# EAGLE design Pico_Feeder_V3 (EAGLE 9.7.0)
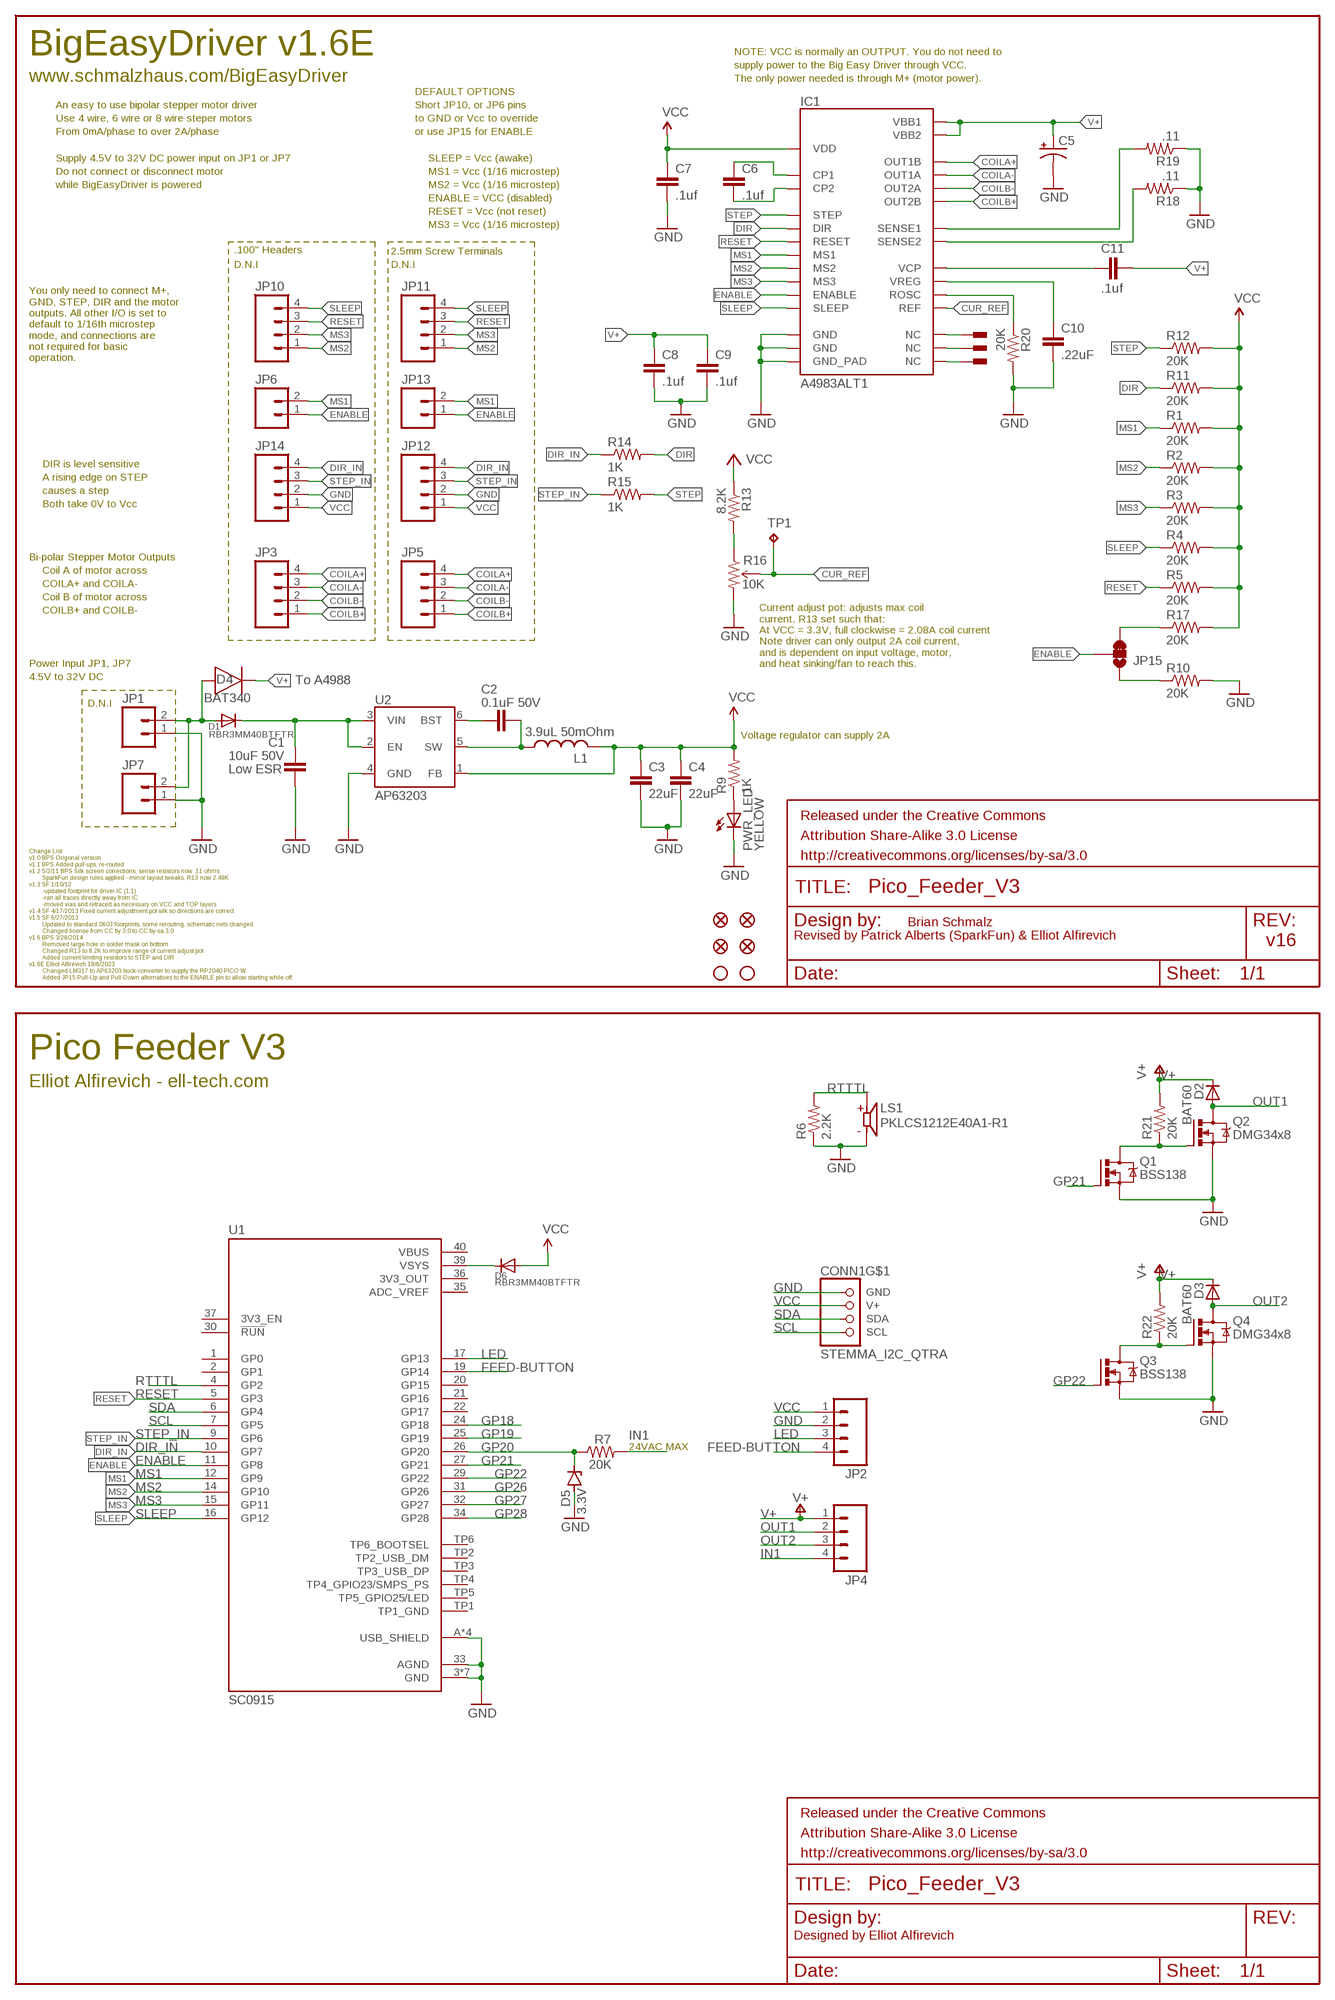
[diagram p0: schematic, sheet 1]

## Parts
C1  10uF 50V  C_CHIP-0805(2012-METRIC)  [CAPC2012X110]
C2  0.1uF 50V  C_CHIP-0805(2012-METRIC)  [CAPC2012X110]
C3  22uF  0.22UF50V-20%,+80%(0603)  [0603-CAP]
C4  22uF  0.22UF50V-20%,+80%(0603)  [0603-CAP]
C5  CPOL-USD  [PANASONIC_D]
C6  .1uf  0.1UF-100V-10%(0603)  [0603-CAP]
C7  .1uf  0.1UF-100V-10%(0603)  [0603-CAP]
C8  .1uf  0.1UF-100V-10%(0603)  [0603-CAP]
C9  .1uf  0.1UF-100V-10%(0603)  [0603-CAP]
C10  .22uF  0.22UF50V-20%,+80%(0603)  [0603-CAP]
C11  .1uf  0.1UF-100V-10%(0603)  [0603-CAP]
CONN1  STEMMA_I2C_QTRA  [JST_SH4_RA]
D1  RBR3MM40BTFTR  DIODE_SOD-123FL  [SOD-123FL]
D2  BAT60  DIODE-SOD323-R  [SOD323-R]
D3  BAT60  DIODE-SOD323-R  [SOD323-R]
D4  BAT340  DIODEDO-214AC(SMA)  [DIOM5226X290N]
D5  3.3V  ZENER_DO-219-AC(SOD323F)  [SODFL2513X70]
D6  RBR3MM40BTFTR  DIODE_SOD-123FL  [SOD-123FL]
FID1  FIDUCIAL1X2  [FIDUCIAL-1X2]
FID2  FIDUCIAL1X2  [FIDUCIAL-1X2]
FID3  FIDUCIAL1X2  [FIDUCIAL-1X2]
FID4  FIDUCIAL1X2  [FIDUCIAL-1X2]
FRAME1  FRAME-LETTER  [CREATIVE_COMMONS]
FRAME2  FRAME-LETTER  [CREATIVE_COMMONS]
IC1  A4983ALT1  [QFN-28-5MM_ALT1]
JP1  M02PTH  [1X02]
JP2  M04SCREW_LOCK  [SCREWTERMINAL-3.5MM-4_LOCK]
JP3  M04PTH  [1X04]
JP4  M04SCREW_LOCK  [SCREWTERMINAL-3.5MM-4_LOCK]
JP5  M04SCREW_LOCK  [SCREWTERMINAL-3.5MM-4_LOCK]
JP6  M02PTH  [1X02]
JP7  M023.5MM_LOCK  [SCREWTERMINAL-3.5MM-2_LOCK]
JP8  STAND-OFF  [STAND-OFF]
JP9  STAND-OFF  [STAND-OFF]
JP10  M04PTH  [1X04]
JP11  M04SCREW_LOCK  [SCREWTERMINAL-3.5MM-4_LOCK]
JP12  M04SCREW_LOCK  [SCREWTERMINAL-3.5MM-4_LOCK]
JP13  M023.5MM_LOCK  [SCREWTERMINAL-3.5MM-2_LOCK]
JP14  M04PTH  [1X04]
JP15  JUMPER-SMT_3_1-NC_TRACE_SILK  [SMT-JUMPER_3_1-NC_TRACE_SILK]
L1  3.9uL 50mOhm  L-LQH55  [LQH55]
LS1  PKLCS1212E40A1-R1  [SPKR_PKLCS1212E40A1-R1]
PWR_LED  YELLOW  LED0603  [LED-0603]
Q1  BSS138  NMOSFETSOT23-GSD  [SOT23]
Q2  DMG34x8  NMOSFETSOT23-GSD  [SOT23]
Q3  BSS138  NMOSFETSOT23-GSD  [SOT23]
Q4  DMG34x8  NMOSFETSOT23-GSD  [SOT23]
R1  20K  20KOHM1/10W5%(0603)  [0603-RES]
R2  20K  20KOHM1/10W5%(0603)  [0603-RES]
R3  20K  20KOHM1/10W5%(0603)  [0603-RES]
R4  20K  20KOHM1/10W5%(0603)  [0603-RES]
R5  20K  20KOHM1/10W5%(0603)  [0603-RES]
R6  2.2K  240OHM1/10W1%(0603)  [0603-RES]
R7  20K  1KOHM1/10W1%(0603)  [0603-RES]
R9  1K  1KOHM1/10W1%(0603)  [0603-RES]
R10  20K  20KOHM1/10W5%(0603)  [0603-RES]
R11  20K  20KOHM1/10W5%(0603)  [0603-RES]
R12  20K  20KOHM1/10W5%(0603)  [0603-RES]
R13  8.2K  8.2KOHM-1/10W-5%(0603)  [0603-RES]
R14  1K  1KOHM1/10W1%(0603)  [0603-RES]
R15  1K  1KOHM1/10W1%(0603)  [0603-RES]
R16  10K  TRIMPOT3MM-2  [TRIMPOT-3MM-2]
R17  20K  20KOHM1/10W5%(0603)  [0603-RES]
R18  .11  0.11OHM1/2W1%(2010)  [R2010]
R19  .11  0.11OHM1/2W1%(2010)  [R2010]
R20  20K  20KOHM1/10W5%(0603)  [0603-RES]
R21  20K  240OHM1/10W1%(0603)  [0603-RES]
R22  20K  240OHM1/10W1%(0603)  [0603-RES]
TP1  TPPAD1-13  [P1-13]
U1  SC0915  [MODULE_SC0915]
U2  AP63203  [SOT23-6]
U$3  PAD  [PAD-0.008]
U$4  PAD  [PAD-0.008]
U$5  PAD  [PAD-0.008]

## Nets
COILA+: IC1.P$21(OUT1B) JP3.4 JP5.4
COILA-: IC1.P$24(OUT1A) JP3.3 JP5.3
COILB+: IC1.P$1(OUT2B) JP3.1 JP5.1
COILB-: IC1.P$26(OUT2A) JP3.2 JP5.2
CUR_REF: IC1.P$17(REF) R16.2(WIPER) TP1.TP
DIR: IC1.P$19(DIR) R11.1 R14.2
DIR_IN: JP12.4 JP14.4 R14.1 U1.10(GP7)
ENABLE: IC1.P$2(ENABLE) JP6.1 JP13.1 JP15.2 U1.11(GP8)
FEED-BUTTON: JP2.4 U1.19(GP14)
GND: C1.2 C3.2 C4.2 C5.- C7.2 C8.2 C9.2 C10.2 CONN1.1(GND) D5.2(A) IC1.P$3(GND) IC1.P$18(GND) IC1.P$29(GND_PAD) JP1.1 JP2.2 JP7.1 JP12.2 JP14.2 LS1.N PWR_LED.C Q1.2(S) Q2.2(S) Q3.2(S) Q4.2(S) R6.1 R10.2 R16.3(CW) R18.1 R19.1 R20.2 U1.3(GND) U1.8(GND) U1.13(GND) U1.18(GND) U1.23(GND) U1.28(GND) U1.33(AGND) U1.38(GND) U1.A(USB_SHIELD) U1.B(USB_SHIELD) U1.C(USB_SHIELD) U1.D(USB_SHIELD) U2.4(GND)
GP18: U1.24(GP18)
GP19: U1.25(GP19)
GP20: D5.1(C) R7.1 U1.26(GP20)
GP21: Q1.1(G) U1.27(GP21)
GP22: Q3.1(G) U1.29(GP22)
GP26: U1.31(GP26)
GP27: U1.32(GP27)
GP28: U1.34(GP28)
IN1: JP4.4 R7.2
LED: JP2.3 U1.17(GP13)
MS1: IC1.P$9(MS1) JP6.2 JP13.2 R1.1 U1.12(GP9)
MS2: IC1.P$10(MS2) JP10.1 JP11.1 R2.1 U1.14(GP10)
MS3: IC1.P$11(MS3) JP10.2 JP11.2 R3.1 U1.15(GP11)
N$1: C2.1 U2.6(BST)
N$2: PWR_LED.A R9.1
N$3: R13.2 R16.1(CCW)
N$4: C2.2 L1.1 U2.5(SW)
N$5: IC1.P$7(NC) U$3.P$1
N$6: C1.1 D1.C U2.2(EN) U2.3(VIN)
N$7: IC1.P$20(NC) U$4.P$1
N$8: C6.1 IC1.P$4(CP1)
N$9: C6.2 IC1.P$5(CP2)
N$10: IC1.P$25(NC) U$5.P$1
N$11: Q1.3(D) Q2.1(G) R21.1
N$12: D1.A D4.2(A) JP1.2 JP7.2
N$13: D6.C U1.39(VSYS)
N$14: Q3.3(D) Q4.1(G) R22.1
N$15: JP15.3 R17.1
N$16: JP15.1 R10.1
N$19: IC1.P$13(ROSC) R20.1
N$20: C10.1 IC1.P$8(VREG)
N$21: C11.1 IC1.P$6(VCP)
N$31: IC1.P$27(SENSE2) R18.2
N$32: IC1.P$23(SENSE1) R19.2
OUT1: D2.A JP4.2 Q2.3(D)
OUT2: D3.A JP4.3 Q4.3(D)
RESET: IC1.P$12(RESET) JP10.3 JP11.3 R5.1 U1.5(GP3)
RTTTL: LS1.P R6.2 U1.4(GP2)
SCL: CONN1.4(SCL) U1.7(GP5)
SDA: CONN1.3(SDA) U1.6(GP4)
SLEEP: IC1.P$14(SLEEP) JP10.4 JP11.4 R4.1 U1.16(GP12)
STEP: IC1.P$16(STEP) R12.1 R15.2
STEP_IN: JP12.3 JP14.3 R15.1 U1.9(GP6)
V+: C5.+ C8.1 C9.1 C11.2 D2.C D3.C D4.1(C) IC1.P$22(VBB1) IC1.P$28(VBB2) JP4.1 R21.2 R22.2
VCC: C3.1 C4.1 C7.1 CONN1.2(V+) D6.A IC1.P$15(VDD) JP2.1 JP12.1 JP14.1 L1.2 R1.2 R2.2 R3.2 R4.2 R5.2 R9.2 R11.2 R12.2 R13.1 R17.2 U2.1(FB)
Unconnected: CONN1.MT1(MT) CONN1.MT2(MT) U1.1(GP0) U1.2(GP1) U1.20(GP15) U1.21(GP16) U1.22(GP17) U1.30(!RUN) U1.37(3V3_EN) U1.TP2(TP2_USB_DM) U1.TP3(TP3_USB_DP) U1.TP4(TP4_GPIO23/SMPS_PS) U1.TP5(TP5_GPIO25/LED) U1.TP6(TP6_BOOTSEL)

## Notes on the sheet
- BigEasyDriver v1.6E | NOTE: VCC is normally an OUTPUT. You do not need to
- supply power to the Big Easy Driver through VCC.
- www.schmalzhaus.com/BigEasyDriver | The only power needed is through M+ (motor power).
- DEFAULT OPTIONS
- An easy to use bipolar stepper motor driver | Short JP10, or JP6 pins
- Use 4 wire, 6 wire or 8 wire steper motors | to GND or Vcc to override
- From 0mA/phase to over 2A/phase | or use JP15 for ENABLE
- Supply 4.5V to 32V DC power input on JP1 or JP7 | SLEEP = Vcc (awake)
- Do not connect or disconnect motor | MS1 = Vcc (1/16 microstep)
- while BigEasyDriver is powered | MS2 = Vcc (1/16 microstep)
- ENABLE = VCC (disabled)
- RESET = Vcc (not reset)
- MS3 = Vcc (1/16 microstep)
- .100" Headers | 2.5mm Screw Terminals
- D.N.I | D.N.I
- You only need to connect M+, 
  GND, STEP, DIR and the motor 
  outputs. All other I/O is set to 
  default to 1/16th microstep 
  mode, and connections are 
  not required for basic 
  operation.
- DIR is level sensitive
- A rising edge on STEP
- causes a step
- Both take 0V to Vcc
- Bi-polar Stepper Motor Outputs
- Coil A of motor across
- COILA+ and COILA-
- Coil B of motor across
- COILB+ and COILB-
- Power Input JP1, JP7
- Current adjust pot: adjusts max coil
  current. R13 set such that:
  At VCC = 3.3V, full clockwise = 2.08A coil current
  Note driver can only output 2A coil current,
  and is dependent on input voltage, motor,
  and heat sinking/fan to reach this.
- 4.5V to 32V DC
- To A4988
- D.N.I
- Voltage regulator can supply 2A
- Low ESR
- Change List:
- v1.0 BPS Origonal version
- v1.1 BPS Added pull-ups, re-routed
- v1.2 5/2/11 BPS Silk screen corrections, sense resistors now .11 ohms
- SparkFun design rules applied - minor layout tweaks, R13 now 2.49K
- v1.3 SF 1/10/12
- -updated footprint for driver IC (1:1)
- -ran all traces directly away from IC
- -moved vias and retraced as necessary on VCC and TOP layers
- v1.4 SF 4/17/2013 Fixed current adjustment pot silk so directions are correct
- v1.5 SF 6/27/2013
- Updated to standard 0603 foorprints, some rerouting, schematic nets changed | Brian Schmalz
- Changed license from CC by 3.0 to CC by-sa 3.0
- v1.6 BPS 3/28/2014 | Revised by Patrick Alberts (SparkFun) & Elliot Alfirevich
- Removed large hole in solder mask on bottom | v16
- Changed R13 to 8.2K to improve range of current adjust pot
- Added current limiting resistors to STEP and DIR
- v1.6E Elliot Alfirevich 18/6/2023
- Changed LM317 to AP63203 buck-converter to supply the RP2040 PICO W.
- Added JP15 Pull-Up and Pull-Down alternatives to the ENABLE pin to allow starting while off.
- Pico Feeder V3
- Elliot Alfirevich - ell-tech.com
- 24VAC MAX
- Designed by Elliot Alfirevich

## Power pins joined to a net without a drawn wire
3V3_OUT: U1.36(3V3_OUT)
ADC_VREF: U1.35(ADC_VREF)
TP1_GND: U1.TP1(TP1_GND)
VBUS: U1.40(VBUS)

## Library data of the parts
C1 C2 = Capacitor:C: Capacitor - Generic; CATEGORY: Capacitor
C3 C4 C10 = SparkFun-Capacitors:0.22UF50V-20%,+80%(0603): CAP-09885; PROD_ID: CAP-09885; VALUE: 0.22uF
C5 = adafruit:CPOL-US: POLARIZED CAPACITOR, American symbol
C6-C9 C11 = SparkFun-Capacitors:0.1UF-100V-10%(0603): CAP-08390; PROD_ID: CAP-08390; VALUE: 0.1uF
CONN1 = adafruit_electromech:STEMMA_I2C; LCSC: C145961
D1 D6 = adafruit:DIODE: Diode SMADIODE - SMA Surface Mount Package 20V 1A Schottky Diode Digikey: 641-1014-6-ND DO-1N4148 - Through Hole Small Current Diode SOD-123 20V 1 A (.5mV Vf) Schottky Diode - Digikey: MBRX120TPMSCT-ND SOD-323 10V 570mA (.38mV Vf, 3ns) Schottky Diode - Digikey: ZLLS410CT-ND SOD-523 30V 30mA Schottky Diode (RB751S-40TE61) - Digikey: RB751S-40TE61CT-ND SOT23-R/W - SOT23 Package (R = Solder Paste/Reflow Ovens, W = Hand-Soldering) BAT54Film 40V 300mA - Digikey: 497-7162-1-ND
D2 D3 = diode:DIODE-: DIODE
D4 = diode:DIODE: Diode Rectifier - Generic; CATEGORY: Diode; SUB-CATEGORY: Rectifier; VALUE: DIODE
D5 = diode:ZENER: Zener Diode - Generic; CATEGORY: Diode; SUB-CATEGORY: Zener; VALUE: ZENER
FID1-FID4 = SparkFun-Aesthetics:FIDUCIAL: Fiducial Alignment Points Various fiducial points for machine vision alignment.
FRAME1 FRAME2 = SparkFun-Aesthetics:FRAME-LETTER: Schematic Frame Standard 8.5x11 US Letter frame
IC1 = Testing:A4983: DMOS Microstepping Driver with Translator
JP1 JP6 = SparkFun:M02: Header 2 Standard 2-pin 0.1" header. Use with straight break away headers (SKU : PRT-00116), right angle break away headers (PRT-00553), swiss pins (PRT-00743), machine pins (PRT-00117), and female headers (PRT-00115). Molex polarized connector foot print use with SKU : PRT-08233 with associated crimp pins and housings.
JP2 JP4 JP5 JP11 JP12 = BigEasyDriver_v11:M04: Header 4 Standard 4-pin 0.1" header. Use with straight break away headers (SKU : PRT-00116), right angle break away headers (PRT-00553), swiss pins (PRT-00743), machine pins (PRT-00117), and female headers (PRT-00115). Molex polarized connector foot print use with SKU : PRT-08231 with associated ...
JP3 JP10 JP14 = SparkFun:M04: Header 4 Standard 4-pin 0.1" header. Use with straight break away headers (SKU : PRT-00116), right angle break away headers (PRT-00553), swiss pins (PRT-00743), machine pins (PRT-00117), and female headers (PRT-00115). Molex polarized connector foot print use with SKU : PRT-08231 with associated ...
JP7 JP13 = BigEasyDriver_v11:M02: Header 2 Standard 2-pin 0.1" header. Use with straight break away headers (SKU : PRT-00116), right angle break away headers (PRT-00553), swiss pins (PRT-00743), machine pins (PRT-00117), and female headers (PRT-00115). Molex polarized connector foot print use with SKU : PRT-08233 with associated crimp pins and housings.
JP8 JP9 = SparkFun-7-28-09:STAND-OFF: Stand Off This is the mechanical footprint for a #4 phillips button head screw. Use the keepout ring to avoid running the screw head into surrounding components. SKU : PRT-00447
JP15 = SparkFun-Jumpers:JUMPER-SMT_3_1-NC_TRACE: Normally closed trace jumper (1 of 2 connections) This jumper has a trace between two pads so it's normally closed (NC). The other connection is normally open (NO). Use a razor knife to open the connection. For best results follow the IPC guidelines for cutting traces: Cutout at least 0.063 mm (0.005 in). Remove all loose material to clean up the cut area. Seal the cut with an approved epoxy. Reapply solder to reclose the connection, or to close the NO connection.
L1 = adafruit:L; LCSC: C5289415
LS1 = PKLCS1212E40A1-R1:PKLCS1212E40A1-R1: Buzzers Transducer, Externally Driven Piezo 1.5V 2kHz 70dB @ 1.5V, 10cm Surface Mount Solder Pads; MANUFACTURER: Murata Electronics; MAXIMUM_PACKAGE_HEIGHT: 3.0 mm; PARTREV: January 22, 2018; STANDARD: Manufacturer Recommendations
PWR_LED = SparkFun03_30_09:LED: LEDs Standard schematic elements and footprints for 5mm, 3mm, 1206, and 0603 sized LEDs. 5mm - Spark Fun Electronics SKU : COM-00529 (and others)
Q1-Q4 = Transistor:NMOSFET: N-Channel MOSFET - Generic; CATEGORY: Transistor; SUB-CATEGORY: MOSFET; TYPE: N-Channel; VALUE: NMOSFET
R1-R5 R10-R12 R17 R20 = SparkFun-Resistors:20KOHM1/10W5%(0603): RES-09231; PROD_ID: RES-09231
R6 R21 R22 = SparkFun-Resistors:240OHM1/10W1%(0603): RES-07849; PROD_ID: RES-07849; VALUE: 240
R7 = SparkFun-Resistors:1KOHM1/10W1%(0603): RES-07856; PROD_ID: RES-07856; VALUE: 1K
R9 R14 R15 = SparkFun-Resistors:1KOHM1/10W1%(0603): RES-07856; PROD_ID: RES-07856
R13 = SparkFun-Resistors:8.2KOHM-1/10W-5%(0603): RES-10646; PROD_ID: RES-10646
R16 = SparkFun-Electromechanical:TRIMPOT: Various small potentiometers for "set-and-forget" applications
R18 R19 = SparkFun-Resistors:0.11OHM1/2W1%(2010): RES-08354; PROD_ID: RES-08354
TP1 = testpad:TP: Test pad
U1 = SC0915:SC0915; MANUFACTURER: Pi Supply; PARTREV: 1.9; SNAPEDA_PN: SC0918; STANDARD: Manufacturer Recommendations
U2 = AP63203:AP63203: Diodes Inc. AP63203 3.8V-32V input 3.3V Buck The AP63200/AP63201/AP63203/AP63205 is a 2A, synchronous buck converter with a wide input voltage range of 3.8V to 32V and fully integrates a 125mΩ high-side power MOSFET and a 68mΩ lowside power MOSFET to provide high-efficiency step-down DC/DC conversion; PROD_ID: VREG-15244
U$3-U$5 = Testing:PAD

## Board
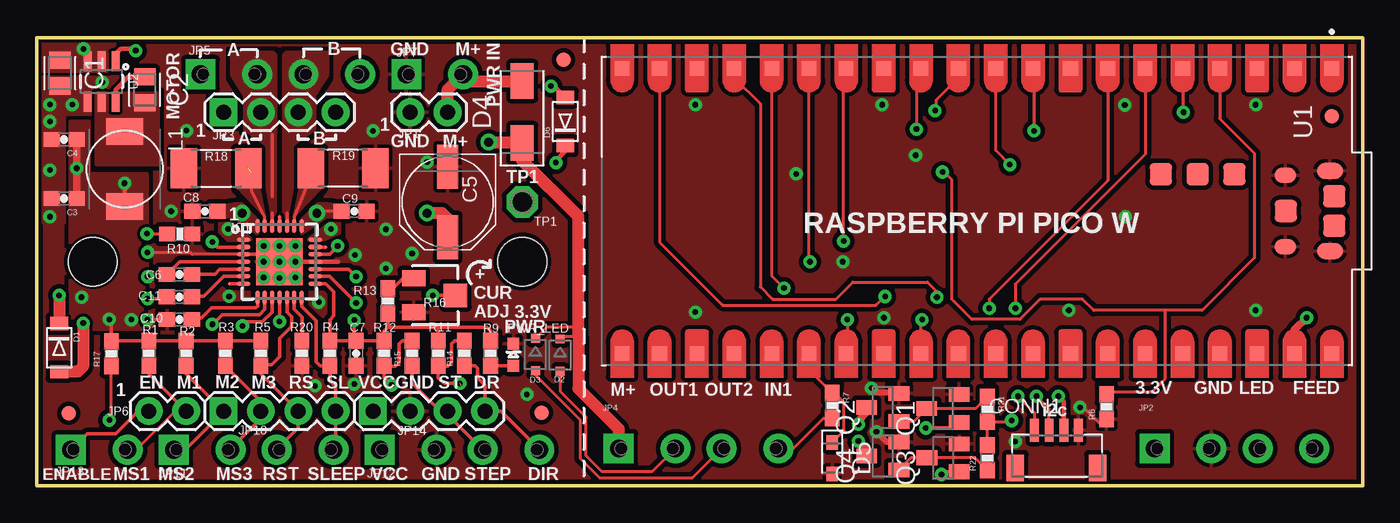
[diagram p1: board, top side]
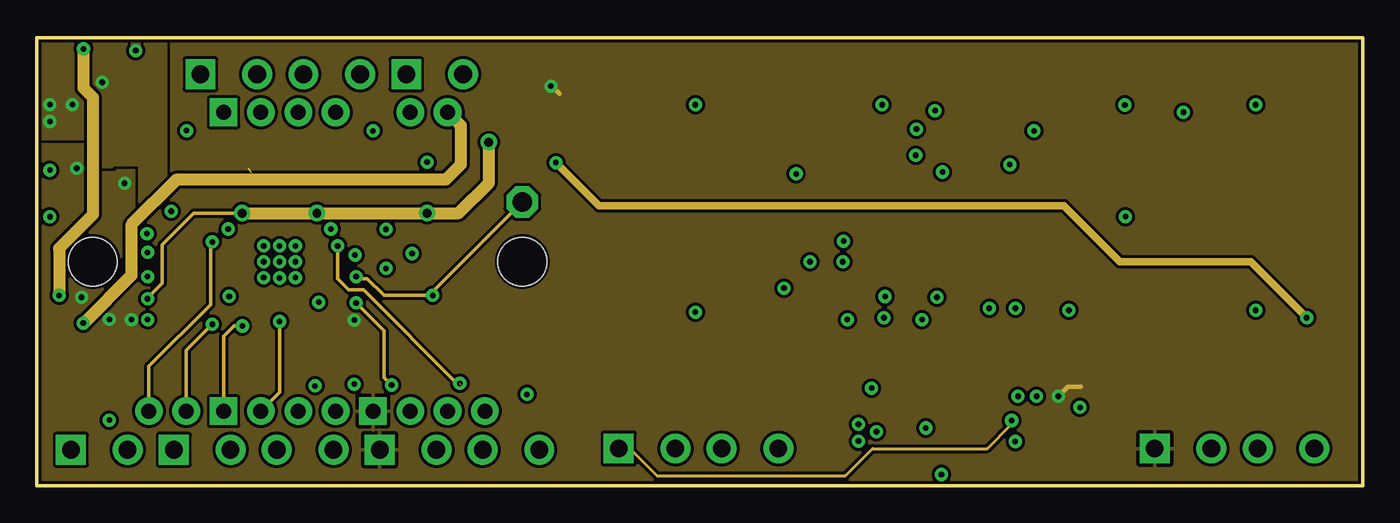
[diagram p2: board, inner layer VCC]
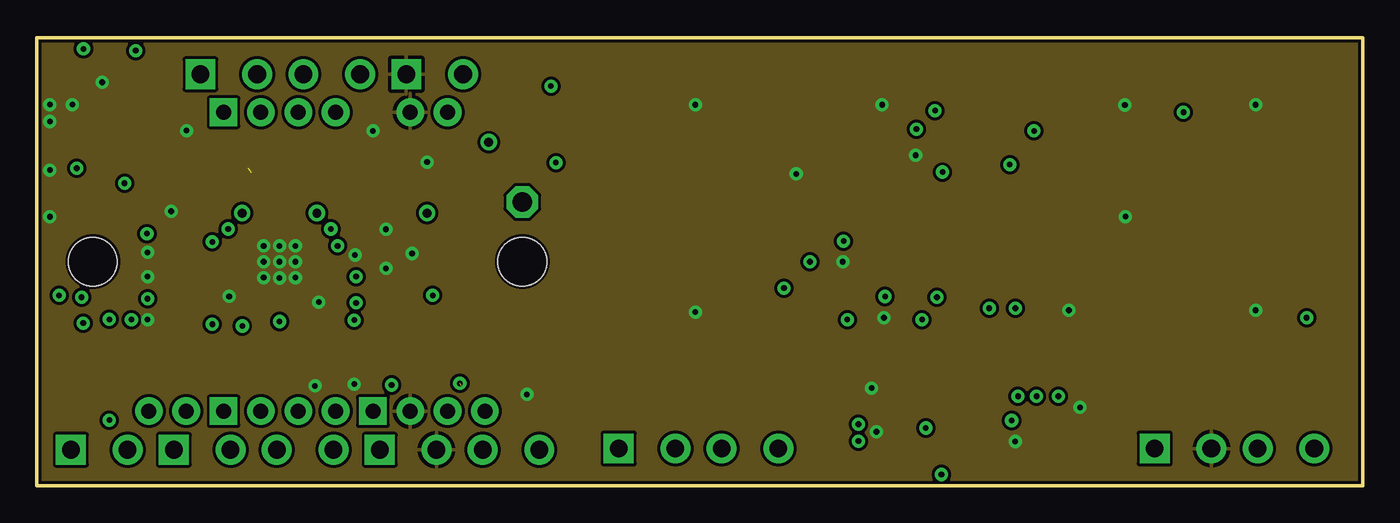
[diagram p3: board, inner layer GND]
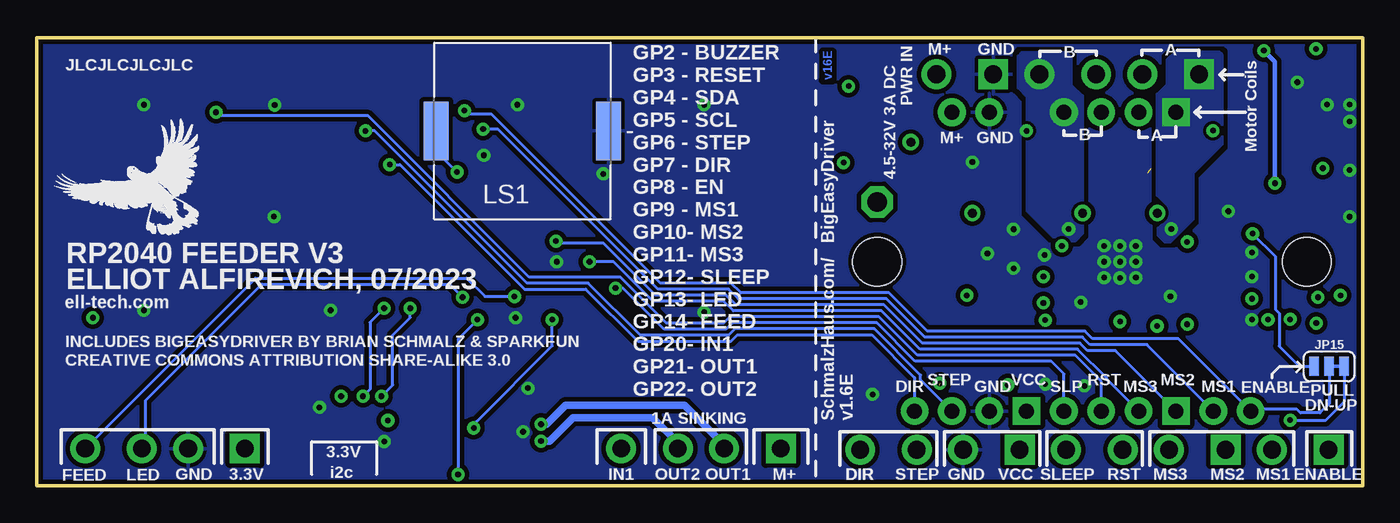
[diagram p4: board, bottom side, seen from below]

Size 90.17 x 30.48 mm. Coordinates in mm from the lower left corner, seen from the top.
Outline: 0,30.48 90.17,30.48 90.17,0 0,0 0,30.48
Copper layers (1+2*15+16): Top 0.035mm / dielectric 1.5mm / VCC 0.035mm / dielectric 0.15mm / GND 0.035mm / dielectric 0.2mm / Bottom 0.035mm
Design rules "SparkFun *": minimum track width 7mil, minimum drill 15mil, track to track 8mil, track to pad 8mil, pad to pad 8mil, via to via 8mil, smd to smd 8mil, copper to edge 8mil, drill to drill 8mil, minimum pad ring 12mil, minimum via ring 10mil, stop-mask expansion 4mil, vias tented up to drill 24mil, thermal gap 10mil

### Footprints (pad centres in the part's own frame; a part is rotated, then mirrored left to right if it is on the bottom)
CAPC2012X110 = smd 1.165 x 1.465: 1 -0.875,0; 2 0.875,0
0603-CAP = smd 1.1 x 1: 1 -0.85,0; 2 0.85,0
PANASONIC_D = smd 3 x 1.4: + 2.4,0; - -2.4,0
JST_SH4_RA = smd 0.6 x 1.55: 1 1.5,0.924; 2 0.5,0.924; 3 -0.5,0.924; 4 -1.5,0.924 | smd 1.2 x 1.8: MT1 -2.8,-1.624; MT2 2.8,-1.624
SOD-123FL = smd 0.91 x 1.22: A 1.637,0; C -1.637,0
SOD323-R = smd 0.6 x 0.6: A 1.1,0; C -1.1,0
DIOM5226X290N = smd 2.392 x 1.565: 1 -2.108,0; 2 2.108,0
SODFL2513X70 = smd 0.985 x 0.774: 1 -1.065,0; 2 1.065,0
FIDUCIAL-1X2 = smd 1 x 1: 1 0,0
QFN-28-5MM_ALT1 = smd 0.94 x 0.3: P$1 -2.44,1.5; P$2 -2.44,1; P$3 -2.44,0.5; P$4 -2.44,0; P$5 -2.44,-0.5; P$6 -2.44,-1; P$7 -2.44,-1.5; P$15 2.44,-1.5; P$16 2.44,-1; P$17 2.44,-0.5; P$18 2.44,0; P$19 2.44,0.5; P$20 2.44,1; P$21 2.44,1.5 | smd 0.3 x 0.94: P$8 -1.5,-2.44; P$9 -1,-2.44; P$10 -0.5,-2.44; P$11 0,-2.44; P$12 0.5,-2.44; P$13 1,-2.44; P$14 1.5,-2.44; P$22 1.5,2.44; P$23 1,2.44; P$24 0.5,2.44; P$25 0,2.44; P$26 -0.5,2.44; P$27 -1,2.44; P$28 -1.5,2.44 | smd 3.175 x 3.175: P$29 0,0
1X02 = drill 1.016 pad 1.88: 1 0,0; 2 2.54,0
SCREWTERMINAL-3.5MM-4_LOCK = drill 1.2 pad 2.032 square: 1 -0.178,0 | drill 1.2 pad 2.032: 2 3.678,0; 3 6.822,0; 4 10.678,0
1X04 = drill 1.016 pad 1.88 square: 1 0,0 | drill 1.016 pad 1.88: 2 2.54,0; 3 5.08,0; 4 7.62,0
SCREWTERMINAL-3.5MM-2_LOCK = drill 1.2 pad 2.032 square: 1 -0.178,0 | drill 1.2 pad 2.032: 2 3.678,0
STAND-OFF = hole 3.302: 0,0
SMT-JUMPER_3_1-NC_TRACE_SILK = smd 0.635 x 1.27: 1 -1.016,0; 2 0,0; 3 1.016,0
LQH55 = smd 1.8 x 2.5: 1 -2.55,0; 2 2.55,0
SPKR_PKLCS1212E40A1-R1 = smd 1.708 x 4: N 5.854,0; P -5.854,0
LED-0603 = smd 0.8 x 0.8: A 0,-0.75; C 0,0.75
SOT23 = smd 1 x 1.4: 1 -0.95,-1.1; 2 0.95,-1.1; 3 0,1.1
0603-RES = smd 1.1 x 1: 1 -0.85,0; 2 0.85,0
TRIMPOT-3MM-2 = smd 1.092 x 1.6: 1 -1.155,-1.421; 3 1.155,-1.421 | smd 1.6 x 1.6: 2 0,1.421
R2010 = smd 1.8 x 2.7: 1 -2.2,0; 2 2.2,0
P1-13 = drill 1.321 pad 2.159 octagon: TP 0,0
MODULE_SC0915 = smd 1 x 1: 1 -9.69,24.13; 2 -9.69,21.59; 3 -9.69,19.05; 4 -9.69,16.51; 5 -9.69,13.97; 6 -9.69,11.43; 7 -9.69,8.89; 8 -9.69,6.35; 9 -9.69,3.81; 10 -9.69,1.27; 11 -9.69,-1.27; 12 -9.69,-3.81; 13 -9.69,-6.35; 14 -9.69,-8.89; 15 -9.69,-11.43; 16 -9.69,-13.97; 17 -9.69,-16.51; 18 -9.69,-19.05; 19 -9.69,-21.59; 20 -9.69,-24.13; 21 9.69,-24.13; 22 9.69,-21.59; 23 9.69,-19.05; 24 9.69,-16.51; 25 9.69,-13.97; 26 9.69,-11.43; 27 9.69,-8.89; 28 9.69,-6.35; 29 9.69,-3.81; 30 9.69,-1.27; 31 9.69,1.27; 32 9.69,3.81; 33 9.69,6.35; 34 9.69,8.89; 35 9.69,11.43; 36 9.69,13.97; 37 9.69,16.51; 38 9.69,19.05; 39 9.69,21.59; 40 9.69,24.13 | smd 1.1 x 1.8: A -2.725,24; B 2.725,24 | smd 1.05 x 1.45: C -2.425,20.97; D 2.425,20.97 | smd 1.5 x 1.5: TP1 0,21; TP2 1,24.3; TP3 -1,24.3; TP4 -2.5,17.5; TP5 -2.5,15; TP6 -2.5,12.5
SOT23-6 = smd 0.55 x 1.35: 1 -0.95,-1.375; 2 0,-1.375; 3 0.95,-1.375; 4 0.95,1.375; 5 0,1.375; 6 -0.95,1.375
PAD-0.008 = smd 0.203 x 0.203: P$1 0,0

### Placement (x,y rotation side)
C1  1.58,28.06 270 top
C2  7.34,26.93 270 top
C3  1.86,19.54 180 top
C4  1.86,23.55 180 top
C5  27.94,19.3 270 top
C6  9.7,14.38 0 top
C7  21.72,9.02 270 top
C8  11.43,18.67 180 top
C9  21.59,18.67 0 top
C10  9.7,11.3 180 top
C11  9.7,12.85 180 top
CONN1  69.34,2.85 0 top
D1  1.52,9.4 270 top
D2  35.59,8.89 270 top
D3  33.91,8.93 270 top
D4  33,25.41 90 top
D5  54.1,1.89 270 top
D6  35.94,24.77 90 top
FID1  2.16,4.95 0 top
FID2  35.81,28.96 0 top
FID3  88.06,25.13 0 top
FID4  34.34,4.99 0 top
FRAME1  -2.89,49.53 0 top  (outside the outline)
FRAME2  57.15,-10.16 0 top  (outside the outline)
IC1  16.51,15.24 0 top
JP1  25.4,25.4 0 top
JP2  76.2,2.54 0 top
JP3  12.7,25.4 0 top
JP4  39.75,2.54 0 top
JP5  11.31,27.98 0 top
JP6  7.62,5.08 0 top
JP7  25.31,27.98 0 top
JP8  3.81,15.24 0 top
JP9  33.02,15.24 0 top
JP10  12.7,5.08 0 top
JP11  9.5,2.46 0 top
JP12  23.5,2.46 0 top
JP13  2.5,2.46 0 top
JP14  22.86,5.08 0 top
JP15  2.29,8.13 0 bottom
L1  5.98,21.53 270 top
LS1  57.15,24.13 0 bottom
PWR_LED  32.41,8.92 0 top
Q1  61.62,5.26 90 top
Q2  57.53,5.33 90 top
Q3  61.63,1.91 90 top
Q4  57.53,2.03 90 top
R1  7.62,9.02 90 top
R2  10.16,9.02 90 top
R3  12.83,9.02 90 top
R4  19.94,9.02 90 top
R5  15.24,9.02 90 top
R6  72.75,5.38 90 top
R7  54.1,5.46 270 top
R9  30.86,9.02 90 top
R10  9.73,17.12 0 top
R11  27.3,9.02 90 top
R12  23.62,9.02 90 top
R13  23.88,12.57 90 top
R14  29.08,9.02 90 top
R15  25.53,9.02 90 top
R16  27.05,12.95 270 top
R17  5.07,8.99 90 top
R18  12.19,21.59 0 top
R19  20.83,21.59 180 top
R20  18.03,9.02 270 top
R21  64.64,5.21 270 top
R22  64.64,1.91 90 top
TP1  33.02,19.3 0 top
U1  63.94,18.69 270 top
U2  4.41,27.49 180 top
U$3  13.11,13.74 0 top
U$4  19.66,16.23 0 top
U$5  16.51,18.29 0 top

### Tracks (layer width: path | path; a pad name or v marks a point on that pad's centre or on a via)
COILA+  (via drill 0.38)
  other vias: 20,17.46
  pour Bottom (isolate 0.203, no thermals): 20.76,16.64 22.8,18.67 22.8,26.39 22.81,26.43 23.43,27.05 23.43,29.21 23.18,29.49 20.13,29.46 19.84,29.1 19.84,27.3 19.84,27.3 19.84,27.28 19.84,27.27 19.84,27.26 19.84,27.26 19.83,27.25 19.82,27.23 19.82,27.23 19.82,27.22 19.81,27.21 19.79,27.2 19.79,27.2 19.05,26.53 19.05,17.14 19.56,16.64
  pour Top (isolate 0.203, no thermals): 18.47,16.79 18.47,16.69 19.46,16.71 20.62,17.22 20.62,17.86 19.89,17.86
COILA-
  Top 0.254: IC1.P$24 17.01,18.53 17.02,18.54
  pour Top (isolate 0.203, no thermals): 16.97,18.21 17.04,18.21 17.04,18.32 17.04,18.33 17.04,18.34 17.04,18.35 17.05,18.36 17.4,20.24 17.4,23.05 17.4,23.06 17.4,23.07 17.4,23.08 17.4,23.09 17.4,23.1 17.41,23.11 17.41,23.12 17.42,23.13 17.42,23.13 17.43,23.14 17.44,23.15 17.45,23.15 18.92,24.26 18.92,26.5 18.92,26.51 18.92,26.52 18.92,26.53 18.93,26.54 18.93,26.55 18.93,26.56 18.94,26.57 18.94,26.58 19.81,27.97 19.81,29.48 16.94,29.48 16.74,29.24 16.76,18.59 16.94,18.37 16.95,18.36 16.95,18.36 16.96,18.35 16.96,18.34 16.97,18.32 16.97,18.32 16.97,18.31 16.97,18.3
COILB+  (via drill 0.38)
  other vias: 13.02,17.46
  pour Top (isolate 0.203, no thermals): 12.94,16.7 14.57,16.7 14.57,16.83 13.21,17.86 12.42,17.86 12.42,17.25
  pour Bottom (isolate 0.203, no thermals): 11.54,21.22 11.56,21.19 11.56,18.1 13.08,16.57 13.46,16.57 13.91,17.02 13.91,17.53 13.25,18.18 13.22,18.21 13.21,18.25 13.21,18.96 13.22,19 13.97,19.75 13.97,26.63 13.32,27.29 13.29,27.31 13.27,27.35 13.27,28.99 12.74,29.53 9.8,29.54 9.59,29.35 9.59,23.18
COILB-
  Top 0.254: 16,19.68 16,23.88 | IC1.P$26 16.01,18.53 16,18.54
  pour Top (isolate 0.203, no thermals): 15.98,18.19 16.05,18.19 16.05,18.3 16.05,18.31 16.05,18.32 16.05,18.32 16.06,18.34 16.06,18.35 16.07,18.36 16.07,18.36 16.08,18.37 16.26,18.59 16.28,29.24 16.1,29.46 13.21,29.46 13.21,27.94 14.08,26.58 14.08,26.57 14.09,26.56 14.09,26.55 14.09,26.54 14.1,26.53 14.1,26.52 14.1,26.51 14.1,26.5 14.1,24.26 15.57,23.15 15.58,23.15 15.59,23.14 15.6,23.13 15.6,23.13 15.61,23.12 15.61,23.11 15.62,23.1 15.62,23.09 15.62,23.08 15.62,23.07 15.62,23.06 15.62,23.05 15.62,20.27 15.97,18.41 15.98,18.4 15.98,18.39 15.98,18.38 15.98,18.37
CUR_REF  (via drill 0.38)
  Top 0.254: v26.92,12.95 R16.2 | IC1.P$17 21.2,14.74 v21.72,14.22
  VCC 0.254: TP1.TP 26.92,13.21 v26.92,12.95 23.62,12.95 22.48,14.1 21.84,14.1 v21.72,14.22
DIR  (via drill 0.38)  (1 unrouted)
  Top 0.254: IC1.P$19 19.93,15.74 20.46,16.27 v20.46,16.32 | R14.2 28.41,9.87 28.19,9.65 28.19,8.38 27.94,8.13 27.34,8.13 R11.1 27.3,7.37 27.7,6.97 v28.77,6.97
  VCC 0.254: v20.46,16.32 20.46,14.08 21.21,13.34 22.23,13.34 28.7,6.86 28.83,6.86
DIR_IN  (via drill 0.38)
  Top 0.203: v66.17,21.84 65.21,22.8 U1.10
  Top 0.254: R14.1 29.81,8.17 29.97,8 29.97,7.37 30.48,6.86 JP14.4 31.56,5.08 JP12.4
  Bottom 0.203: JP14.4 30.48,7.37 33.39,10.27 42.52,10.27 42.95,9.84 49.3,9.84 52.84,13.38 57.01,13.38 65.47,21.84 v66.17,21.84
ENABLE  (via drill 0.38)
  Top 0.203: U1.11 62.67,27.75 61.15,26.22 61.15,25.59 61.09,25.53 v61.09,25.51
  Top 0.254: IC1.P$2 12.28,16.24 v11.94,16.59 | JP13.1 2.33,2.46 3.42,3.54 5.36,3.54 7.02,5.2 7.5,5.2 JP6.1
  VCC 0.254: JP6.1 7.62,8.13 11.81,12.32 11.81,16.46 v11.94,16.59
  Bottom 0.203: v61.09,25.51 60.83,25.25 59.24,25.25 47.76,13.78 42.95,13.78 42.29,13.12 32.21,13.12 29.61,10.52 18.89,10.52 18.38,10.01 12.55,10.01 JP6.1 7.49,5.21 7.41,5.21 7.4,5.22 4.49,5.22 4.24,4.97 2.91,4.97 2.29,5.59 JP15.2
FEED-BUTTON  (via drill 0.38)
  Top 0.203: U1.19 42.35,16.58 46.64,12.29 57.06,12.29 57.67,12.9 v57.69,12.88
  Bottom 0.203: v57.69,12.88 59.7,12.88 60.94,14.12 75.3,14.12 JP2.4
GND  (via drill 0.38)
  Top 0.203: R6.1 72.75,4.28 72.24,4.28 71.18,5.33 v70.95,5.33 | v7.53,15.88 10.44,15.88 10.57,15.75 10.57,15.74 IC1.P$3 | C10.2 v7.53,11.3
  Top 0.254: 15.3,15.75 15.3,15.37 v15.43,15.24 15.43,15.74 IC1.P$3 | 10.49,15.82 10.57,15.75
  Top 0.305: v17.59,15.24 IC1.P$18 20.51,15.24
  Top 0.406: Q2.2 58.56,6.35 57.06,6.35 v56.77,6.65 | Q4.2 57.8,2.98 v57.1,3.68
  other vias: 15.43,16.32 16.51,16.32 17.59,16.32 16.51,15.24 15.43,14.16 16.51,14.14 17.59,14.16 18.92,6.79 21.59,6.92 33.33,6.22 10.19,24.16 9.14,18.67 21.64,15.7 25.53,15.8 22.86,24.13 82.88,25.91 57.48,25.91 57.61,11.43 44.78,25.91 70.18,11.94 82.88,11.94 44.78,11.81 73.99,25.9 51.64,21.21 66.54,3.02 74.03,18.31 54.82,15.24 59.77,22.48 4.45,27.44 2.42,25.92 0.9,25.92 0.9,24.77 0.9,21.47 0.9,18.3 7.53,14.22 26.54,22.01 19.18,12.5 13.08,12.88 23.75,14.78 23.75,17.45
  pour Top (isolate 0.305, rank 3): 0,0 90.17,0 90.17,30.48 0,30.48
  pour Bottom (isolate 0.305, rank 3): 0,0 90.17,0 90.17,30.48 0,30.48
  pour GND: 0,0 90.17,0 90.17,30.48 0,30.48
  pour Top (rank 2, no thermals): 3.72,26.93 3.78,26.95 5.94,26.95 5.94,27.79 0.15,27.79 0.15,17.93 1.88,17.93 1.88,25.18 1.9,25.23 1.95,25.28 2,25.3 3.66,25.3 3.66,26.83 3.68,26.88
  pour VCC: 5.15,21.8 5.19,21.82 6.88,21.82 6.92,21.8 6.94,21.77 6.96,21.74 6.96,19.15 8.79,19.15 8.79,30.38 0.1,30.38 0.1,23.6 3.83,23.6 3.87,23.58 3.9,23.55 3.91,23.52 3.91,21.69 5.11,21.69 5.11,21.74 5.12,21.77
GP20
  Top 0.203: U1.26 52.51,7.9 R7.1 54.27,6.31 54.91,5.67 54.91,3.76 D5.1
GP21  (via drill 0.38)
  Top 0.203: Q1.1 62.34,3.94 v60.45,3.94 | v55.12,11.3 55.12,9.07 U1.27
  Bottom 0.203: v60.45,3.94 60.27,4.12 60.27,4.37 55.12,9.52 v55.12,11.3
GP22  (via drill 0.38)
  Top 0.203: Q3.1 61.7,0.96 v61.52,0.78 | U1.29 60.13,11.23 v60.2,11.3
  Bottom 0.203: v60.2,11.3 61.52,9.98 v61.52,0.78
IN1
  Top 0.203: JP4.4 51.43,2.54 53.5,4.61 R7.2
LED  (via drill 0.38)
  Top 0.203: U1.17 47.43,27.75 49.21,25.97 49.21,13.53 50.04,12.7 54.35,12.7 55.5,13.85 60.58,13.85 61.21,13.21 v61.21,12.83
  Bottom 0.203: JP2.3 82.78,2.78 82.78,5.81 74.87,13.72 62.1,13.72 v61.21,12.83
MS1  (via drill 0.38)
  Top 0.203: 6.78,2.46 9.4,5.08 | U1.12 59.82,28.07 v59.82,24.26
  Top 0.254: R1.1 7.62,7.62 JP6.2 9.4,5.08 | JP13.2 6.78,2.46 | IC1.P$9 15.51,12.01 15.15,11.65 12.6,11.65 v11.94,10.99
  VCC 0.254: JP6.2 10.16,9.21 v11.94,10.99
  Bottom 0.203: JP6.2 14.68,9.6 18.55,9.6 19.05,10.11 29.77,10.11 32.38,12.71 42.46,12.71 43.12,13.37 47.93,13.37 58.82,24.26 v59.82,24.26
MS2  (via drill 0.38)
  Top 0.203: v54.86,16.64 54.86,28.19 U1.14
  Top 0.254: JP11.1 10.08,2.46 JP10.1 10.16,7.62 R2.1 | IC1.P$10 16.01,11.81 16,11.81 15.34,11.15 14.26,11.15 v13.98,10.87
  VCC 0.254: JP10.1 12.7,10.16 13.44,10.9 13.96,10.9 v13.98,10.87
  Bottom 0.203: JP10.1 16.82,9.2 18.71,9.2 19.22,9.7 29.94,9.7 32.55,12.31 42.63,12.31 43.29,12.97 48.1,12.97 51.64,16.51 54.74,16.51 v54.86,16.64
MS3  (via drill 0.38)
  Top 0.203: v52.58,15.24 52.51,15.31 U1.15
  Top 0.254: JP11.2 13.18,2.51 15.24,4.57 JP10.2 15.24,5.75 R3.1 | IC1.P$11 v16.51,11.18
  VCC 0.254: v16.51,11.18 16.51,6.35 JP10.2
  Bottom 0.203: JP10.2 17.37,7.21 17.37,7.28 19.39,9.3 30.11,9.3 32.72,11.9 42.8,11.9 43.46,12.56 48.27,12.56 50.95,15.24 v52.58,15.24
N$1
  Top 0.305: C2.1 6.21,27.8 5.36,26.95 U2.6
N$2
  Top 0.254: R9.1 PWR_LED.A
N$3
  Top 0.254: R13.2 24.22,13.42 24.89,14.1 25.62,14.1 R16.1
N$4
  pour Top (no thermals): 4.09,21.87 8.23,21.87 8.23,26.64 4.09,26.64
N$5
  Top 0.254: IC1.P$7 U$3.P$1
N$6  (via drill 0.38)
  Top 0.508: U2.3 3.46,29.42 v3.17,29.7
  Top 0.813: v1.52,12.95 D1.C
  VCC 0.813: v3.17,29.72 v3.17,29.7 3.17,27.05 3.81,26.42 3.81,18.44 1.52,16.15 v1.52,12.95
  pour Top (no thermals): 0.15,28.22 5.44,28.22 5.44,30.33 0.15,30.33
N$7
  Top 0.254: IC1.P$20 U$4.P$1
N$8
  Top 0.254: IC1.P$4 9.72,15.24 C6.1
N$9
  Top 0.254: IC1.P$5 12.45,14.74 12.12,14.4 10.58,14.4 C6.2
N$10
  Top 0.254: IC1.P$25 U$5.P$1
N$11
  Top 0.203: Q2.1 59.64,4.38 Q1.3 63.85,5.26 R21.1
N$12  (via drill 0.38)
  Top 0.813: D4.2 29.45,27.52 JP7.2 27.94,26.93 JP1.2 | v3.16,11.07 3.16,8.12 2.79,7.76 D1.A
  VCC 0.813: JP1.2 28.83,24.51 28.83,21.84 27.81,20.83 9.53,20.83 6.44,17.74 6.44,14.31 3.19,11.07 v3.16,11.07
N$13  (via drill 0.38)
  Top 0.305: D6.C 35.94,22.73 35.31,22.1 v35.31,21.97
  Top 0.508: v86.36,11.43 85.53,10.6 U1.39
  VCC 0.508: v35.31,21.97 38.23,19.05 69.85,19.05 73.66,15.24 82.55,15.24 v86.36,11.43
N$14
  Top 0.203: Q4.1 59.45,1.91 Q3.3 63.79,1.91 R22.1
N$15  (via drill 0.38)
  Top 0.203: R17.1 5.07,4.61 v4.93,4.47
  Bottom 0.203: JP15.3 1.27,5.71 2.54,4.45 4.91,4.45 v4.93,4.47
N$16  (via drill 0.38)
  Top 0.203: R10.1 7.52,17.12 v7.49,17.14
  Bottom 0.203: JP15.1 4.32,8.13 5.69,9.5 5.69,11.74 5.94,11.99 5.94,15.6 v7.49,17.14
N$19
  Top 0.254: IC1.P$13 17.51,12.01 18.03,11.48 R20.1
N$20
  Top 0.254: IC1.P$8 15.01,12.22 14.9,12.1 11.9,12.1 11.23,11.43 10.68,11.43 C10.1
N$21
  Top 0.254: IC1.P$6 12.72,14.24 11.35,12.88 10.58,12.88 C11.1
N$31  (1 unrouted)
  Top 0.203: 14.61,21.3 14.61,20.07 15.49,18.29 IC1.P$27
  Top 0.254: 13.97,21.59 R18.2
  pour Top (isolate 0.203, no thermals): 15.48,18.3 15.48,18.17 15.54,18.2 15.11,20.32 13.59,20.32 15.45,18.37 15.47,18.36 15.47,18.35 15.47,18.35 15.47,18.34 15.48,18.32 15.48,18.32 15.48,18.32
N$32
  Top 0.203: IC1.P$23 17.53,18.29 18.54,20.83 R19.2
  pour Top (isolate 0.203, no thermals): 17.48,18.21 17.55,18.21 17.55,18.32 17.55,18.34 17.55,18.34 17.55,18.34 17.56,18.36 17.57,18.38 17.57,18.38 17.57,18.38 17.58,18.39 19.43,20.32 17.91,20.32
OUT1  (via drill 0.38)
  Top 0.203: D2.A 35.61,7.77 35.61,6.41 37.36,4.66 37.36,2.03 38.43,0.96 41.85,0.96 JP4.2
  Top 0.508: Q2.3 56.43,5 55.88,4.45 v55.88,4.19
  Bottom 0.508: JP4.2 43.43,2.79 46.13,5.49 54.2,5.49 55.5,4.19 v55.88,4.19
OUT2  (via drill 0.38)
  Top 0.203: D3.A 33.91,7.54 36.96,4.49 36.96,1.86 38.26,0.56 44.59,0.56 JP4.3
  Top 0.508: Q4.3 56.39,2.08 56.39,2.54 v55.88,3.05
  Bottom 0.508: JP4.3 46.57,2.93 48.3,4.65 53.71,4.65 55.31,3.05 v55.88,3.05
RESET  (via drill 0.38)
  Top 0.203: v77.98,25.4 77.98,28.31 U1.5
  Top 0.254: JP11.3 16.32,2.48 17.78,3.94 JP10.3 15.24,7.62 R5.1 15.31,8.24 15.99,8.24 16.51,8.76 16.51,10.03 17.34,10.86 17.34,11.49 17.01,11.82 IC1.P$12
  Bottom 0.203: JP10.3 17.78,7.11 19.56,8.89 30.28,8.89 32.88,11.49 43.03,11.49 43.46,11.06 47.35,11.06 50.48,14.2 56.68,14.2 67.63,25.15 77.72,25.15 v77.98,25.4
RTTTL  (via drill 0.38)
  Top 0.203: U1.4 80.45,24.96 82.8,22.61 82.8,15.49 79.25,11.94 76.71,11.94 | 76.71,11.94 71.88,11.94 71.12,12.7 68.23,12.7 66.86,11.33 63.6,11.33 62.23,12.7 62.23,20.83 61.72,21.34 v61.59,21.34 | R6.2 72.87,6.36 75.83,6.36 76.71,7.24 76.71,11.94
  Bottom 0.203: 61.65,21.34 v61.59,21.34 63,22.75 LS1.P 63,22.44
SCL  (via drill 0.38)
  Top 0.203: U1.7 72.83,20.76 64.77,12.7 v64.77,12.08 | CONN1.4 67.84,4.97 v66.73,6.09
  Bottom 0.203: v64.77,12.08 64.77,11.44 65.96,10.25 65.96,6.85 v66.73,6.09
SDA  (via drill 0.38)
  Top 0.203: U1.6 75.37,22.54 66.55,13.72 v66.55,12.08 | CONN1.3 68.84,5.24 v67.98,6.1
  Bottom 0.203: v67.98,6.1 67.51,6.57 67.51,11.11 v66.55,12.08
SLEEP  (via drill 0.38)
  Top 0.203: U1.16 49.97,14.29 v50.81,13.45
  Top 0.254: JP11.4 20.32,2.6 JP10.4 20.32,6.73 19.94,7.11 R4.1 19.27,8.17 18.99,8.45 18.99,11.24 18.01,12.22 IC1.P$14
  Bottom 0.203: JP10.4 20.32,7.62 21.18,8.48 30.45,8.48 33.05,11.09 42.86,11.09 43.29,10.65 47.51,10.65 50.31,13.45 v50.81,13.45
STEP  (via drill 0.38)
  Top 0.254: IC1.P$16 19.92,14.24 v21.72,12.45 | R15.2 24.85,9.87 24.64,9.65 24.64,8.38 24.38,8.13 23.66,8.13 R12.1 23.62,7.37 v24.13,6.86
  VCC 0.254: v21.72,12.45 23.62,10.54 23.62,7.37 v24.13,6.86
STEP_IN  (via drill 0.38)
  Top 0.203: v67.82,24.13 67.82,28.31 U1.9
  Top 0.254: R15.1 25.53,6.99 27.43,5.08 JP14.3 27.94,4.84 JP12.3
  Bottom 0.203: JP14.3 30.07,7.21 30.07,7.53 33.22,10.68 42.69,10.68 43.12,10.25 49.13,10.25 52.67,13.79 56.84,13.79 67.19,24.13 v67.82,24.13
V+  (via drill 0.38, 0.6)
  Top 0.203: 15.01,18.01 IC1.P$28 | v66.29,4.45 66.21,4.36 R21.2 R22.2 | 36.83,10.16 35.76,10.16 D2.C | 36.83,10.79 34.67,10.79 D3.C | v19.05,18.54 19.18,18.67 C9.1
  Top 0.254: 18.01,18.01 IC1.P$22 | C11.2 8.73,12.72 v7.53,12.72
  Top 0.813: C5.+ 27.94,18.16 27.56,18.54 v26.54,18.54 | JP4.1 39.57,3.87 36.83,6.61 36.83,10.16 36.83,10.79 36.83,18.32 32.98,22.17 32.98,23.28 D4.1 32.94,23.37 v30.73,23.37
  VCC 0.203: JP4.1 40.33,2.54 42.17,0.7 54.99,0.7 56.83,2.54 64.64,2.54 66.29,4.19 v66.29,4.45
  VCC 0.254: v13.97,18.54 10.67,18.54 8.53,16.41 8.53,13.79 7.53,12.79 v7.53,12.72
  VCC 0.813: v13.97,18.54 v19.05,18.54 v26.54,18.54 28.7,18.54 30.74,20.58 30.74,23.38 v30.73,23.37
  pour Top (isolate 0.203, no thermals): 14.9,17.18 15.06,17.18 15.06,18.07 13.97,19.18 13.46,19.18 12.37,19 12.37,18.31 13.32,18.31 13.33,18.32 13.34,18.31 13.35,18.31 13.36,18.31 13.37,18.31 13.38,18.3 13.38,18.3 13.39,18.29
  pour Top (isolate 0.203, no thermals): 17.98,17.17 18.11,17.17 19.75,18.29 19.76,18.3 19.77,18.3 19.78,18.31 19.79,18.31 19.8,18.31 19.81,18.31 19.82,18.31 19.83,18.31 20.6,18.29 20.6,19.05 19.81,19.18 19.05,19.18 18.03,18.16
VCC  (via drill 0.38)
  Top 0.203: 5.05,9.86 R17.2
  Top 0.254: 23.88,10.79 27.3,10.79 | R5.2 R3.2 R2.2 R1.2 5.05,9.87 | 21.59,9.87 R4.2 19.94,11.3 20.19,11.56 20.19,13.21 19.66,13.74 IC1.P$15 | 21.59,9.87 C7.1 R12.2 23.62,10.54 23.88,10.79 | R11.2 27.3,10.79 | 27.3,10.79 30.61,10.79 30.86,10.54 R9.2 | 23.88,10.79 R13.1 | 21.59,9.87 v21.59,11.27 | 5.05,9.87 5.05,9.86 | 5.05,9.87 5.05,11.21 v4.94,11.32
  Top 0.305: CONN1.2 69.84,5.72 v69.47,6.1 | L1.2 5.98,20.57 v5.97,20.57 | v6.73,29.59 6.6,29.72 5.71,29.72 5.33,29.34 5.33,28.89 U2.1 | D6.A 35.17,27.18 v34.96,27.18
  Top 0.508: C4.1 v2.71,21.59 v2.71,21.58 C3.1
  VCC 0.305: 70.99,6.73 70.1,6.73 v69.47,6.1 | 35.56,26.67 35.05,27.18 v34.96,27.18
  Bottom 0.305: v5.97,20.57 5.97,28.83 v6.73,29.59
  other vias: 3.05,12.83 6.44,11.3
  pour VCC (rank 2): 0,0 90.17,0 90.17,30.48 0,30.48
  pour Top (no thermals): 7.47,10.69 7.47,21.18 3.65,21.18 3.6,21.21 3.55,21.25 3.53,21.31 3.53,24.74 2.31,24.74 2.31,10.69

### Text on the board
Bottom: v16E
tPlace: A | B | GND | M+ | PWR IN | MOTOR | 1 | 1 | A | B | GND | M+ | TP1 | 1 | RASPBERRY PI PICO W | + | CUR | 3.3V | ADJ | PWR | EN | M1 | M2 | M3 | RS | SL | VCC | GND | ST | DR | 1 | M+ | OUT1 | OUT2 | IN1 | 3.3V | GND | LED | FEED | i2c | ENABLE | MS1 | MS2 | MS3 | RST | SLEEP | VCC | GND | STEP | DIR
bPlace: A | B | GND | M+ | JLCJLCJLCJLC | PWR IN | Motor Coils | A | B | GND | M+ | 4.5-32V 3A DC | BigEasyDriver | RP2040 FEEDER V3 | ELLIOT ALFIREVICH, 07/2023 | ell-tech.com | INCLUDES BIGEASYDRIVER BY BRIAN SCHMALZ & SPARKFUN | CREATIVE COMMONS ATTRIBUTION SHARE-ALIKE 3.0 | MS2 | RST | VCC | STEP | PULL | ENABLE | MS1 | MS3 | SLP | GND | DIR | GP2 - BUZZER / GP3 - RESET / GP4 - SDA / GP5 - SCL / GP6 - STEP / GP7 - DIR / GP8 - EN / GP9 - MS1 / GP10- MS2 / GP11- MS3 / GP12- SLEEP / GP13- LED / GP14- FEED / GP20- IN1 / GP21- OUT1 / GP22- OUT2 | DN-UP | v1.6E | SchmalzHaus.com/ | 1A SINKING | 3.3V | i2c | /Users/elliot/Library/CloudStorage/Dropbox/Projects/Logo/Cockatoo.bmp | ENABLE | MS1 | MS2 | MS3 | RST | SLEEP | VCC | GND | STEP | DIR | DIR | M+ | OUT1 | OUT2 | IN1 | 3.3V | GND | LED | FEED
tValues: BigEasyDriver - Brian Schmalz: http://schmalzhaus.com/BigEasyDriver/index.html | Pico W Feeder - Elliot Alfirevich: https://ell-tech.com/
bStop: /Users/elliot/Library/CloudStorage/Dropbox/Projects/Logo/StopMask.bmp
tDocu: THIS IS A 4-LAYER 2OZ BOARD.